# EAGLE design cheetah_driver_integrated_v2 (EAGLE 6.5.0)
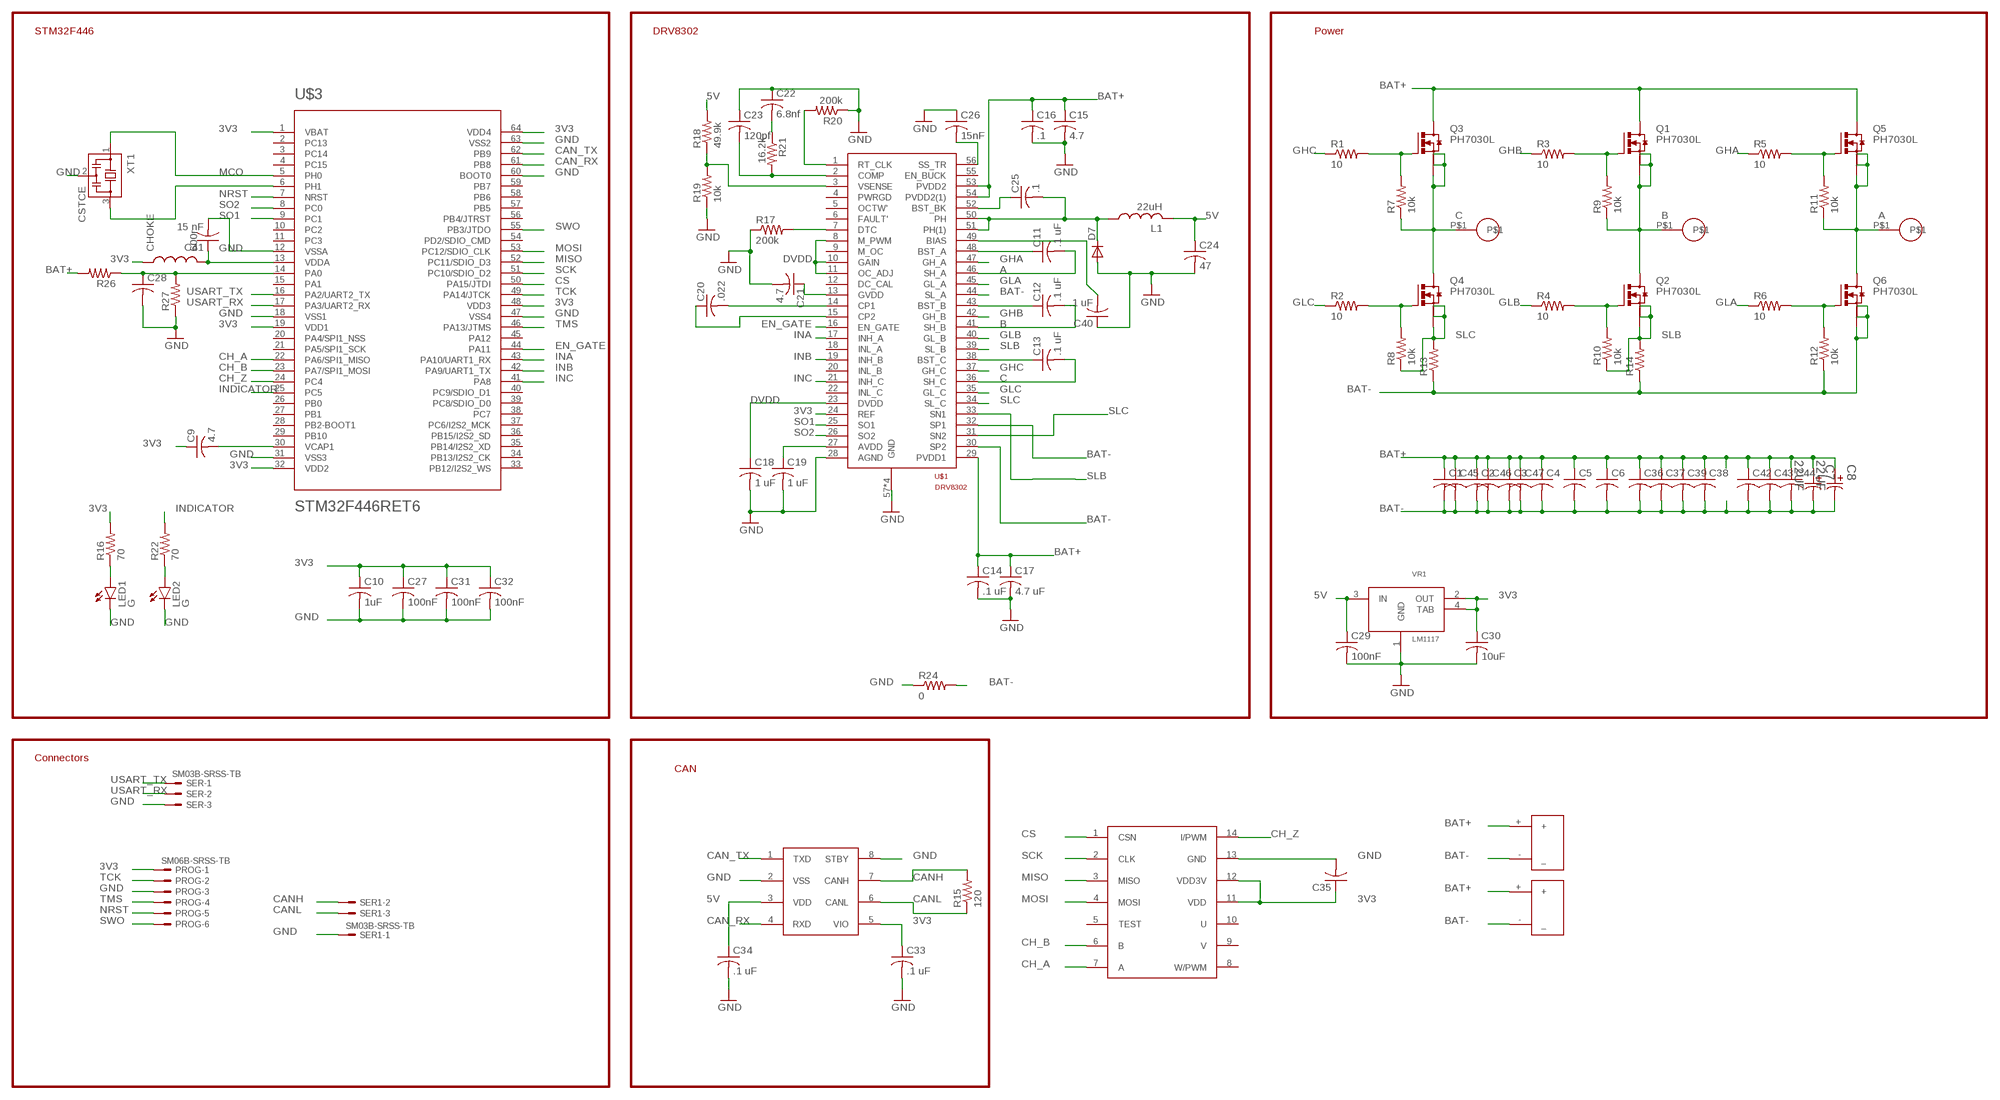
[diagram p0: schematic, sheet 1]

## Parts
C1  C-USC1206  [C1206]
C2  C-USC1206  [C1206]
C3  C-USC1206  [C1206]
C4  C-USC1206  [C1206]
C5  C-USC1206  [C1206]
C6  C-USC1206  [C1206]
C7  22UF  EEE-HD1V220AP-CASE-D  [CAPAE660X610N]
C8  22UF  EEE-HD1V220AP-CASE-D  [CAPAE660X610N]
C9  4.7  C-USC0603  [C0603]
C10  1uF  C-USC0603  [C0603]
C11  .1 uF  C-USC0603  [C0603]
C12  .1 uF  C-USC0603  [C0603]
C13  .1 uF  C-USC0603  [C0603]
C14  .1 uF  C-USC0603  [C0603]
C15  4.7  C-USC0805  [C0805]
C16  .1  C-USC0603  [C0603]
C17  4.7 uF  C-USC0805  [C0805]
C18  1 uF  C-USC0603  [C0603]
C19  1 uF  C-USC0603  [C0603]
C20  .022  C-USC0603  [C0603]
C21  4.7  C-USC0805  [C0805]
C22  6.8nf  C-USC0603  [C0603]
C23  120pf  C-USC0603  [C0603]
C24  47  C-USC1210  [C1210]
C25  .1  C-USC0603  [C0603]
C26  15nF  C-USC0603  [C0603]
C27  100nF  C-USC0603  [C0603]
C28  C-USC0603  [C0603]
C29  100nF  C-USC0603  [C0603]
C30  10uF  C-USC0805K  [C0805K]
C31  100nF  C-USC0603  [C0603]
C32  100nF  C-USC0603  [C0603]
C33  .1 uF  C-USC0603K  [C0603K]
C34  .1 uF  C-USC0603K  [C0603K]
C35  C-USC0603  [C0603]
C36  C-USC1206  [C1206]
C37  C-USC1206  [C1206]
C38  C-USC1206  [C1206]
C39  C-USC1206  [C1206]
C40  .1 uF  C-USC0603  [C0603]
C41  15 nF  C-USC0603  [C0603]
C42  C-USC1206  [C1206]
C43  C-USC1206  [C1206]
C44  C-USC1206  [C1206]
C45  C-USC1206  [C1206]
C46  C-USC1206  [C1206]
C47  C-USC1206  [C1206]
CHOKE  600r  INDUCTOR0603  [0603]
D7  DIODE-DO-214AC  [DO-214AC]
L1  22uH  L-USL4532P  [L4532P]
LED1  G  LED0603  [LED-0603]
LED2  G  LED0603  [LED-0603]
PROG  SM06B-SRSS-TB  [SM06B-SRSS-TB]
Q1  PH7030L  [SOT669]
Q2  PH7030L  [SOT669]
Q3  PH7030L  [SOT669]
Q4  PH7030L  [SOT669]
Q5  PH7030L  [SOT669]
Q6  PH7030L  [SOT669]
R1  10  R-US_R0603  [R0603]
R2  10  R-US_R0603  [R0603]
R3  10  R-US_R0603  [R0603]
R4  10  R-US_R0603  [R0603]
R5  10  R-US_R0603  [R0603]
R6  10  R-US_R0603  [R0603]
R7  10k  R-US_R0603  [R0603]
R8  10k  R-US_R0603  [R0603]
R9  10k  R-US_R0603  [R0603]
R10  10k  R-US_R0603  [R0603]
R11  10k  R-US_R0603  [R0603]
R12  10k  R-US_R0603  [R0603]
R13  R-US_R1210  [R1210]
R14  R-US_R1210  [R1210]
R15  120  R-US_R0603  [R0603]
R16  70  R-US_R0603  [R0603]
R17  200k  R-US_R0603  [R0603]
R18  49.9k  R-US_R0603  [R0603]
R19  10k  R-US_R0603  [R0603]
R20  200k  R-US_R0603  [R0603]
R21  16.2k  R-US_R0603  [R0603]
R22  70  R-US_R0603  [R0603]
R24  0  R-US_R0603  [R0603]
R26  R-US_R0603  [R0603]
R27  R-US_R0603  [R0603]
SER  SM03B-SRSS-TB  [SM03B-SRSS-TB]
SER1  SM03B-SRSS-TB  [SM03B-SRSS-TB]
U$1  DRV8302  [HTSSOP56]
U$2  18_AWG_PAD  [18_AWG_PAD]
U$3  STM32F446RET6  [TQFP64]
U$4  18_AWG_PAD  [18_AWG_PAD]
U$5  18_AWG_PAD  [18_AWG_PAD]
U$6  MCP2561  [SO08]
U$7  AS5147P  [TSSOP14]
U$8  DC_CONNECTOR  [XT30_HORIZONTAL]
U$9  DC_CONNECTOR  [XT30_HORIZONTAL]
VR1  LM1117  [SOT-223]
XT1  CSTCE  [CSTCE]

## Nets
3V3: C9.1 C10.1 C27.1 C30.1 C31.1 C32.1 C33.1 C35.1 CHOKE.1 PROG.1 R16.2 U$1.24(REF) U$3.1(VBAT) U$3.19(VDD1) U$3.32(VDD2) U$3.48(VDD3) U$3.64(VDD4) U$6.5(VIO) U$7.11(VDD) U$7.12(VDD3V) VR1.2(OUT) VR1.4(TAB)
5V: C24.1 C29.1 C34.1 L1.2 R18.2 U$6.3(VDD) VR1.3(IN)
A: C11.2 Q5.1(S) Q5.2(S) Q5.3(S) Q6.MB(D) R11.1 U$1.46(SH_A) U$5.P$1
B: C12.2 Q1.1(S) Q1.2(S) Q1.3(S) Q2.MB(D) R9.1 U$1.41(SH_B) U$4.P$1
BAT+: C1.1 C2.1 C3.1 C4.1 C5.1 C6.1 C7.1 C8.1 C14.1 C15.1 C16.1 C17.1 C36.1 C37.1 C38.1 C39.1 C42.1 C43.1 C44.1 C45.1 C46.1 C47.1 Q1.MB(D) Q3.MB(D) Q5.MB(D) R26.2 U$1.29(PVDD1) U$1.53(PVDD2) U$1.54(PVDD2(1)) U$8.+ U$9.+
BAT-: C1.2 C2.2 C3.2 C4.2 C5.2 C6.2 C7.2 C8.2 C36.2 C37.2 C38.2 C39.2 C42.2 C43.2 C44.2 C45.2 C46.2 C47.2 Q6.1(S) Q6.2(S) Q6.3(S) R12.1 R13.1 R14.1 R24.2 U$1.30(SP2) U$1.32(SP1) U$1.44(SL_A) U$8.-(_) U$9.-(_)
C: C13.2 Q3.1(S) Q3.2(S) Q3.3(S) Q4.MB(D) R7.1 U$1.36(SH_C) U$2.P$1
CAN_RX: U$3.61(PB8) U$6.4(RXD)
CAN_TX: U$3.62(PB9) U$6.1(TXD)
CANH: R15.2 SER1.2 U$6.7(CANH)
CANL: R15.1 SER1.3 U$6.6(CANL)
CH_A: U$3.22(PA6/SPI1_MISO) U$7.7(A)
CH_B: U$3.23(PA7/SPI1_MOSI) U$7.6(B)
CH_Z: U$3.24(PC4) U$7.14(I/PWM)
CS: U$3.50(PA15/JTDI) U$7.1(CSN)
DVDD: C18.1 U$1.8(M_PWM) U$1.10(GAIN) U$1.11(OC_ADJ) U$1.23(DVDD)
EN_GATE: U$1.16(EN_GATE) U$3.44(PA11)
GHA: R5.1 U$1.47(GH_A)
GHB: R3.1 U$1.42(GH_B)
GHC: R1.1 U$1.37(GH_C)
GLA: R6.1 U$1.45(GL_A)
GLB: R4.1 U$1.40(GL_B)
GLC: R2.1 U$1.35(GL_C)
GND: C10.2 C14.2 C15.2 C16.2 C17.2 C18.2 C19.2 C21.2 C22.1 C23.1 C24.2 C26.1 C27.2 C28.2 C29.2 C30.2 C31.2 C32.2 C33.2 C34.2 C35.2 C40.1 C41.2 D7.A LED1.C LED2.C PROG.3 R17.1 R19.1 R20.1 R24.1 R27.1 SER1.1 SER.3 U$1.28(AGND) U$1.57(GND) U$1.P$1(GND) U$1.P$2(GND) U$1.P$3(GND) U$3.12(VSSA) U$3.18(VSS1) U$3.31(VSS3) U$3.47(VSS4) U$3.60(BOOT0) U$3.63(VSS2) U$6.2(VSS) U$6.8(STBY) U$7.13(GND) VR1.1(GND) XT1.2
INA: U$1.17(INH_A) U$3.43(PA10/UART1_RX)
INB: U$1.19(INH_B) U$3.42(PA9/UART1_TX)
INC: U$1.21(INH_C) U$3.41(PA8)
INDICATOR: R22.2 U$3.25(PC5)
MCO: U$3.5(PH0) XT1.1
MISO: U$3.52(PC11/SDIO_D3) U$7.3(MISO)
MOSI: U$3.53(PC12/SDIO_CLK) U$7.4(MOSI)
N$1: Q3.4(G) R1.2 R7.2
N$2: C41.1 CHOKE.2 U$3.13(VDDA)
N$3: C9.2 U$3.30(VCAP1)
N$4: C11.1 U$1.48(BST_A)
N$5: C40.2 U$1.49(BIAS)
N$6: C13.1 U$1.38(BST_C)
N$7: Q4.4(G) R2.2 R8.2
N$8: Q1.4(G) R3.2 R9.2
N$9: C12.1 U$1.43(BST_B)
N$10: Q5.4(G) R5.2 R11.2
N$11: Q6.4(G) R6.2 R12.2
N$12: R18.1 R19.2 U$1.3(VSENSE)
N$13: R17.2 U$1.7(DTC)
N$14: C19.1 U$1.27(AVDD)
N$15: C20.2 U$1.14(CP1)
N$16: C20.1 U$1.15(CP2)
N$17: C21.1 U$1.13(GVDD)
N$18: C23.2 R21.2 U$1.2(COMP)
N$19: R20.2 U$1.1(RT_CLK)
N$20: C22.2 R21.1
N$21: C25.2 D7.C L1.1 U$1.50(PH) U$1.51(PH(1))
N$22: C25.1 U$1.52(BST_BK)
N$23: C26.2 U$1.56(SS_TR)
N$24: C28.1 R26.1 R27.2 U$3.14(PA0)
N$26: LED1.A R16.1
N$27: Q2.4(G) R4.2 R10.2
N$28: LED2.A R22.1
N$30: U$3.6(PH1) XT1.3
NRST: PROG.5 U$3.7(NRST)
SCK: U$3.51(PC10/SDIO_D2) U$7.2(CLK)
SLB: Q2.1(S) Q2.2(S) Q2.3(S) R10.1 R14.2 U$1.33(SN1) U$1.39(SL_B)
SLC: Q4.1(S) Q4.2(S) Q4.3(S) R8.1 R13.2 U$1.31(SN2) U$1.34(SL_C)
SO1: U$1.25(SO1) U$3.9(PC1)
SO2: U$1.26(SO2) U$3.8(PC0)
SWO: PROG.6 U$3.55(PB3/JTDO)
TCK: PROG.2 U$3.49(PA14/JTCK)
TMS: PROG.4 U$3.46(PA13/JTMS)
USART_RX: SER.2 U$3.17(PA3/UART2_RX)
USART_TX: SER.1 U$3.16(PA2/UART2_TX)
Unconnected: U$1.4(PWRGD) U$1.5(OCTW') U$1.6(FAULT') U$1.9(M_OC) U$1.12(DC_CAL) U$1.18(INL_A) U$1.20(INL_B) U$1.22(INL_C) U$1.55(EN_BUCK) U$3.2(PC13) U$3.3(PC14) U$3.4(PC15) U$3.10(PC2) U$3.11(PC3) U$3.15(PA1) U$3.20(PA4/SPI1_NSS) U$3.21(PA5/SPI1_SCK) U$3.26(PB0) U$3.27(PB1) U$3.28(PB2-BOOT1) U$3.29(PB10) U$3.33(PB12/I2S2_WS) U$3.34(PB13/I2S2_CK) U$3.35(PB14/I2S2_XD) U$3.36(PB15/I2S2_SD) U$3.37(PC6/I2S2_MCK) U$3.38(PC7) U$3.39(PC8/SDIO_D0) U$3.40(PC9/SDIO_D1) U$3.45(PA12) U$3.54(PD2/SDIO_CMD) U$3.56(PB4/JTRST) U$3.57(PB5) U$3.58(PB6) U$3.59(PB7) U$7.5(TEST) U$7.8(W/PWM) U$7.9(V) U$7.10(U)

## Notes on the sheet
- STM32F446 | DRV8302 | Power
- Connectors
- CAN

## Library data of the parts
C1-C6 C9-C47 = rcl:C-US: CAPACITOR, American symbol
C7 C8 = Panasonic-EEEH_EEET_EEHZ_EEV:EEE-: Aluminum Electrolytic Capacitors,Surface Mount Type; MPN: EEE-HD1V220AP; OC_FARNELL: 1714745; OC_NEWARK: 15R0968; PACKAGE: CASE-D; SUPPLIER: PANASONIC; TOLERANCE: ±20 %; VOLTAGERATING: 35V
CHOKE = SparkFun-Passives:INDUCTOR: Inductors Basic Inductor/Choke - 0603 and 1206. Footprints are not proven and vary greatly between part numbers. INDUCTOR POWER 3.3UH 4.0A SMD 0.197" L x 0.197" W x 0.177" H (5.00mm x 5.00mm x 4.50mm)
D7 = diode:DIODE-: DIODE
L1 = rcl:L-US: INDUCTOR, American symbol
LED1 LED2 = SparkFun-LED:LED: LEDs Standard schematic elements and footprints for 5mm, 3mm, 1206, and 0603 sized LEDs. 5mm - Spark Fun Electronics SKU : COM-00529 (and others)
PROG = con-jst2:?M06B-SRSS-TB: Disconnectable Crimp style connector, 1.0mm pitch 6 contacts
Q1-Q6 = transistor-power:PH7030L: N-channel TrenchMOS (TM) logic level FET Source: http://www.nxp.com/acrobat_download/datasheets/PH7030L_4.pdf
R1-R22 R24 R26 R27 = rcl:R-US_: RESISTOR, American symbol
SER SER1 = con-jst2:?M03B-SRSS-TB: Disconnectable Crimp style connector, 1.0mm pitch 3 contacts
U$1 = ASL (1):DRV8302
U$2 U$4 U$5 = BenLibrary:18_AWG_PAD
U$3 = BenLibrary:STM32F446RET6: ARM DSP Chip used on the WAV Trigger board.
U$6 = BenLibrary:MCP2561
U$7 = BenLibrary:AS5147P
U$8 U$9 = BenLibrary:DC_CONNECTOR
VR1 = sc_usercreated:LM1117
XT1 = sc_usercreated:CSTCE

## Board
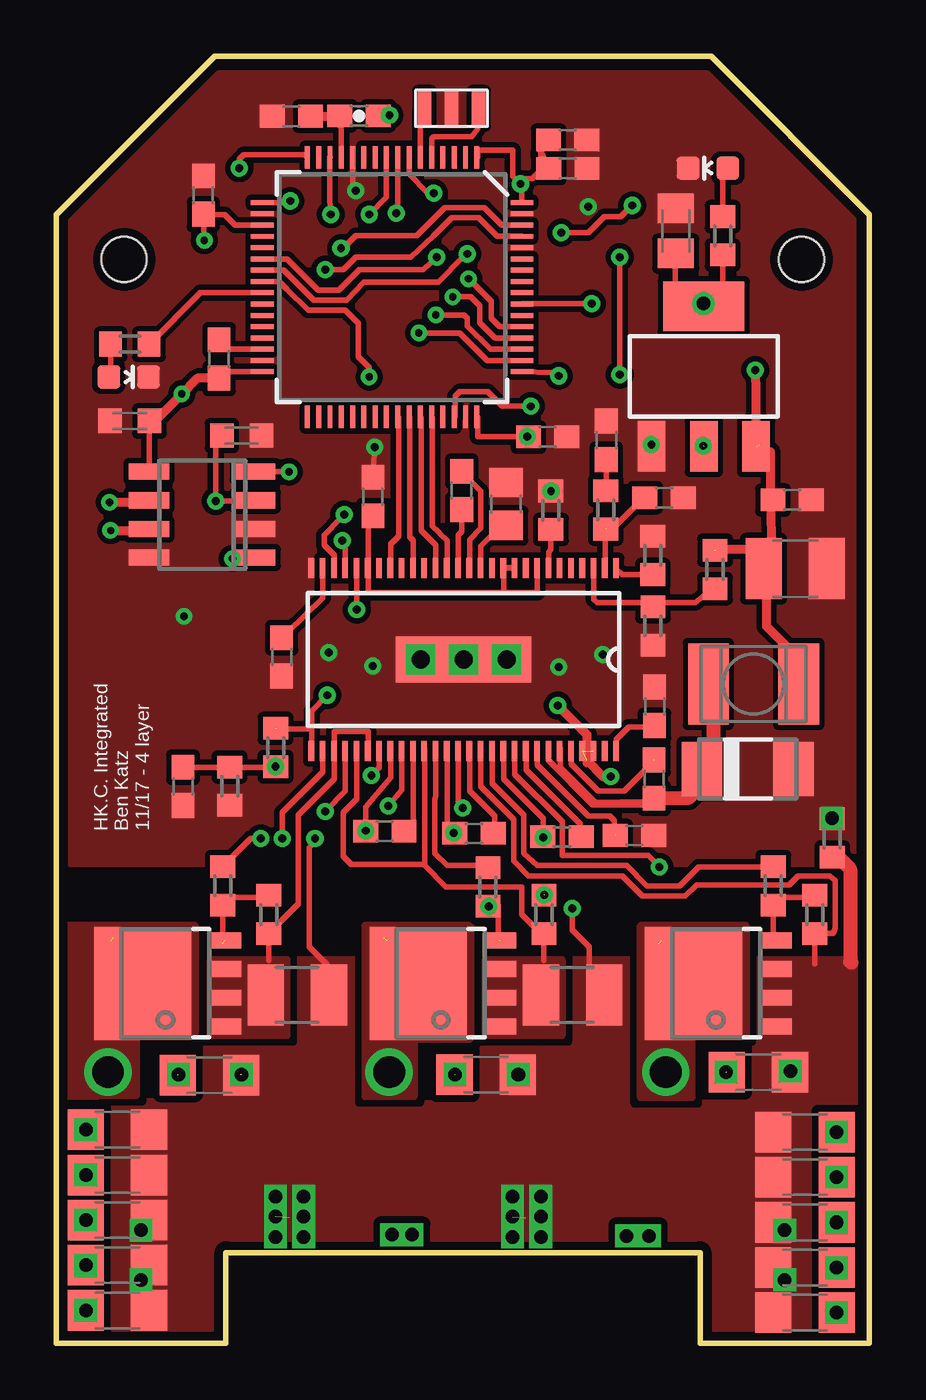
[diagram p1: board, top side]
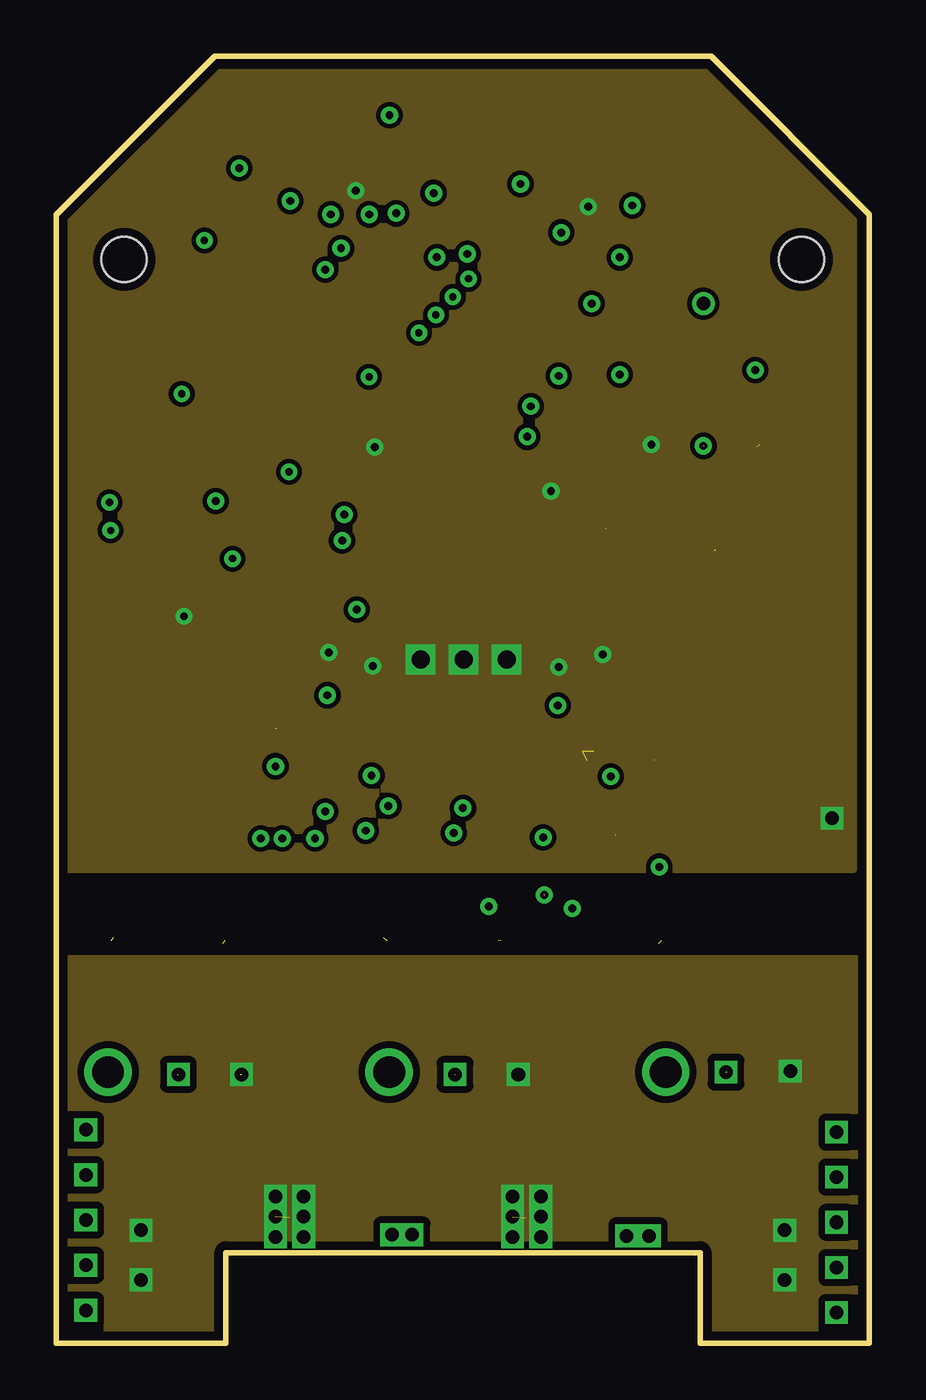
[diagram p2: board, inner layer Route2]
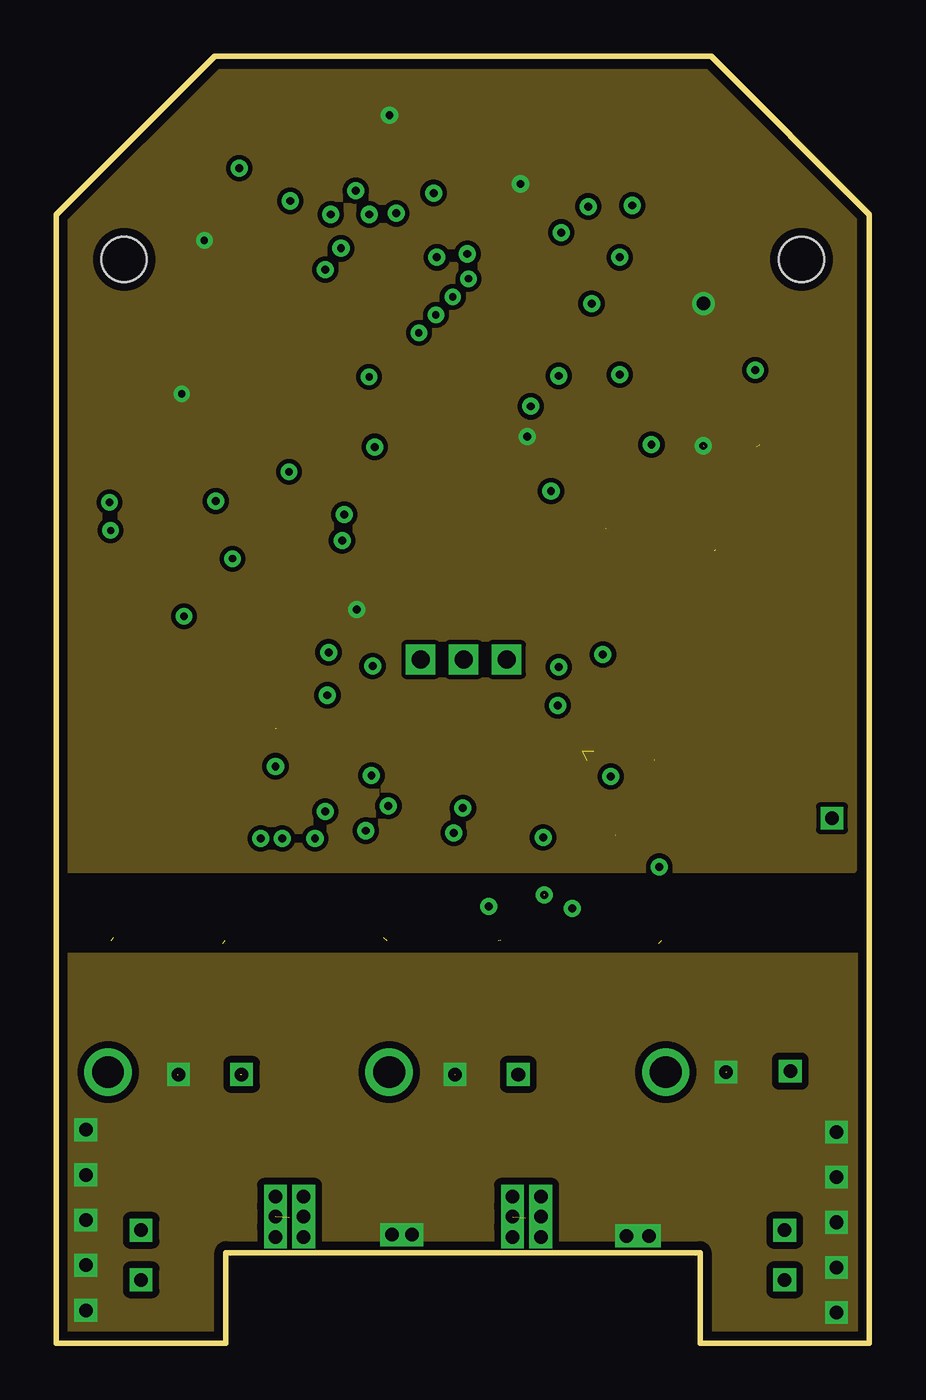
[diagram p3: board, inner layer Route3]
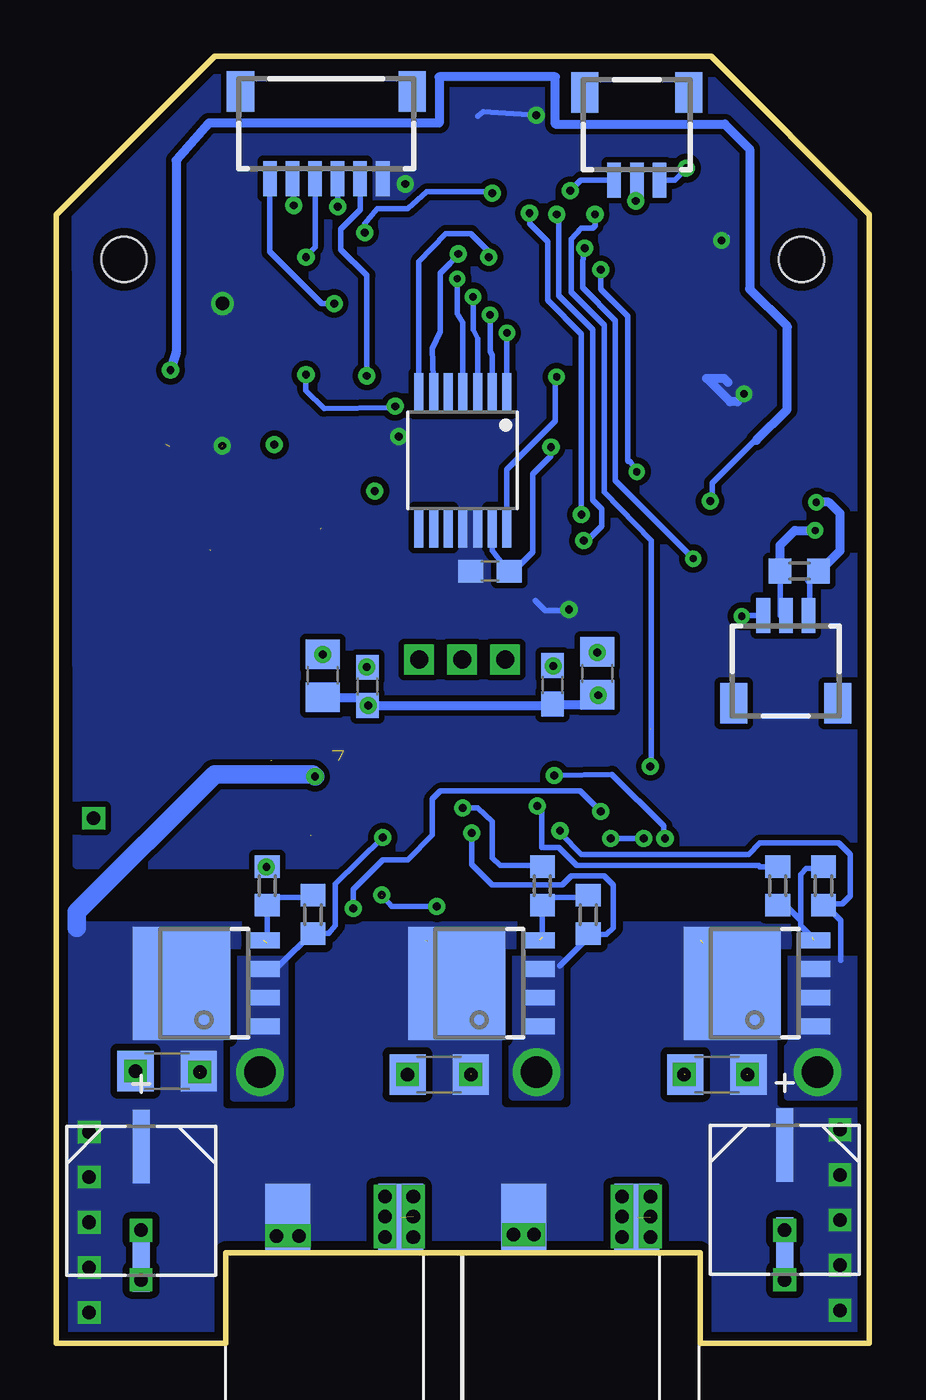
[diagram p4: board, bottom side, seen from below]

Size 36 x 57 mm. Coordinates in mm from the lower left corner, seen from the top.
Outline: 0,0 0,50 7,57 29,57 36,50 36,0 28.5,0 28.5,4 7.5,4 7.5,0 0,0
Copper layers (1*2+3*16): Top 0.035mm / dielectric 1.5mm / Route2 0.035mm / dielectric 0.15mm / Route3 0.035mm / dielectric 0.2mm / Bottom 0.035mm
Design rules "default *": minimum track width 6mil, minimum drill 24mil, track to track 8mil, track to pad 8mil, pad to pad 8mil, via to via 8mil, smd to smd 6mil, copper to edge 15mil, drill to drill 6mil, minimum pad ring 10mil, minimum via ring 8mil, stop-mask expansion 4mil, vias tented up to drill 0mil, thermal gap 10mil
Holes 2 mm at 3,48 33,48

### Footprints (pad centres in the part's own frame; a part is rotated, then mirrored left to right if it is on the bottom)
C1206 = smd 1.6 x 1.8: 1 -1.4,0; 2 1.4,0
CAPAE660X610N = smd 3.251 x 0.762: 1 -2.413,0; 2 2.413,0
C0603 = smd 1.1 x 1: 1 -0.85,0; 2 0.85,0
C0805 = smd 1.3 x 1.5: 1 -0.95,0; 2 0.95,0
C1210 = smd 1.6 x 2.7: 1 -1.4,0; 2 1.4,0
C0805K = smd 1.3 x 1.6: 1 -1,0; 2 1,0
C0603K = smd 1.05 x 1.08: 1 -0.875,0; 2 0.875,0
0603 = smd 1.1 x 1: 1 -0.85,0; 2 0.85,0
DO-214AC = smd 1.8 x 2.4: A 2.025,0; C -2.025,0
L4532P = smd 1.8 x 3.6: 1 -2,0; 2 2,0
LED-0603 = smd 1 x 1: A 0,-0.877; C 0,0.877
SM06B-SRSS-TB = smd 0.6 x 1.55: 1 -2.5,2.975; 2 -1.5,2.975; 3 -0.5,2.975; 4 0.5,2.975; 5 1.5,2.975; 6 2.5,2.975 | smd 1.2 x 1.8: FIT@1 -3.8,-0.9; FIT@2 3.8,-0.9
SOT669 = smd 0.7 x 1.4: 1 -1.905,-2.65; 2 -0.635,-2.65; 3 0.635,-2.65; 4 1.905,-2.65 | smd 5 x 4.3: MB 0,1
R0603 = smd 1 x 1.1: 1 -0.85,0; 2 0.85,0
R1210 = smd 1.6 x 2.7: 1 -1.4,0; 2 1.4,0
SM03B-SRSS-TB = smd 0.6 x 1.55: 1 -1,2.975; 2 0,2.975; 3 1,2.975 | smd 1.2 x 1.8: FIT@1 -2.3,-0.9; FIT@2 2.3,-0.9
HTSSOP56 = smd 0.9 x 0.25: 1 -4.05,6.75; 2 -4.05,6.25; 3 -4.05,5.75; 4 -4.05,5.25; 5 -4.05,4.75; 6 -4.05,4.25; 7 -4.05,3.75; 8 -4.05,3.25; 9 -4.05,2.75; 10 -4.05,2.25; 11 -4.05,1.75; 12 -4.05,1.25; 13 -4.05,0.75; 14 -4.05,0.25; 15 -4.05,-0.25; 16 -4.05,-0.75; 17 -4.05,-1.25; 18 -4.05,-1.75; 19 -4.05,-2.25; 20 -4.05,-2.75; 21 -4.05,-3.25; 22 -4.05,-3.75; 23 -4.05,-4.25; 24 -4.05,-4.75; 25 -4.05,-5.25; 26 -4.05,-5.75; 27 -4.05,-6.25; 28 -4.05,-6.75; 29 4.05,-6.75; 30 4.05,-6.25; 31 4.05,-5.75; 32 4.05,-5.25; 33 4.05,-4.75; 34 4.05,-4.25; 35 4.05,-3.75; 36 4.05,-3.25; 37 4.05,-2.75; 38 4.05,-2.25; 39 4.05,-1.75; 40 4.05,-1.25; 41 4.05,-0.75; 42 4.05,-0.25; 43 4.05,0.25; 44 4.05,0.75; 45 4.05,1.25; 46 4.05,1.75; 47 4.05,2.25; 48 4.05,2.75; 49 4.05,3.25; 50 4.05,3.75; 51 4.05,4.25; 52 4.05,4.75; 53 4.05,5.25; 54 4.05,5.75; 55 4.05,6.25; 56 4.05,6.75 | smd 2.032 x 6: 57 0,0 | drill 0.8 square: P$1 0,0; P$2 0,1.905; P$3 0,-1.905
18_AWG_PAD = drill 1.4: P$1 0,0
TQFP64 = smd 0.22 x 1: 1 -3.75,-5.75; 2 -3.25,-5.75; 3 -2.75,-5.75; 4 -2.25,-5.75; 5 -1.75,-5.75; 6 -1.25,-5.75; 7 -0.75,-5.75; 8 -0.25,-5.75; 9 0.25,-5.75; 10 0.75,-5.75; 11 1.25,-5.75; 12 1.75,-5.75; 13 2.25,-5.75; 14 2.75,-5.75; 15 3.25,-5.75; 16 3.75,-5.75; 33 3.75,5.75; 34 3.25,5.75; 35 2.75,5.75; 36 2.25,5.75; 37 1.75,5.75; 38 1.25,5.75; 39 0.75,5.75; 40 0.25,5.75; 41 -0.25,5.75; 42 -0.75,5.75; 43 -1.25,5.75; 44 -1.75,5.75; 45 -2.25,5.75; 46 -2.75,5.75; 47 -3.25,5.75; 48 -3.75,5.75 | smd 1 x 0.22: 17 5.75,-3.75; 18 5.75,-3.25; 19 5.75,-2.75; 20 5.75,-2.25; 21 5.75,-1.75; 22 5.75,-1.25; 23 5.75,-0.75; 24 5.75,-0.25; 25 5.75,0.25; 26 5.75,0.75; 27 5.75,1.25; 28 5.75,1.75; 29 5.75,2.25; 30 5.75,2.75; 31 5.75,3.25; 32 5.75,3.75; 49 -5.75,3.75; 50 -5.75,3.25; 51 -5.75,2.75; 52 -5.75,2.25; 53 -5.75,1.75; 54 -5.75,1.25; 55 -5.75,0.75; 56 -5.75,0.25; 57 -5.75,-0.25; 58 -5.75,-0.75; 59 -5.75,-1.25; 60 -5.75,-1.75; 61 -5.75,-2.25; 62 -5.75,-2.75; 63 -5.75,-3.25; 64 -5.75,-3.75
SO08 = smd 0.72 x 1.78: 1 -1.905,-2.35; 2 -0.635,-2.35; 3 0.635,-2.35; 4 1.905,-2.35; 5 1.905,2.35; 6 0.635,2.35; 7 -0.635,2.35; 8 -1.905,2.35
TSSOP14 = smd 0.4 x 1.78: 1 -1.95,-2.975; 2 -1.3,-2.975; 3 -0.65,-2.975; 4 0,-2.975; 5 0.65,-2.975; 6 1.3,-2.975; 7 1.95,-2.975; 8 1.95,2.975; 9 1.3,2.975; 10 0.65,2.975; 11 0,2.975; 12 -0.65,2.975; 13 -1.3,2.975; 14 -1.95,2.975
XT30_HORIZONTAL = smd 2 x 3: + -2.5,1.5; - 2.5,1.5
SOT-223 = smd 1.219 x 2.235: 1 -2.311,-3.099; 2 0,-3.099; 3 2.311,-3.099 | smd 3.6 x 2.2: 4 0,3.099
CSTCE = smd 0.6 x 1.6: 1 -1.2,0; 2 0,0; 3 1.2,0

### Placement (x,y rotation side)
C1  31.09,12 0 top
C2  2.7,7.45 0 top
C3  19.03,11.9 0 top
C4  6.78,11.88 0 top
C5  33.15,3.35 180 top
C6  2.7,1.45 0 top
C7  32.25,6.3 270 bottom
C8  3.75,6.35 270 bottom
C9  7.2,43.59 90 top
C10  22.65,52.04 0 top
C11  22.39,22.43 180 top
C12  18.49,22.58 180 top
C13  14.54,22.68 180 top
C14  14.03,29.16 90 bottom
C15  24.21,29.57 90 bottom
C16  22.22,29.09 90 bottom
C17  12.05,29.67 90 bottom
C18  14.01,37.5 90 top
C19  9.97,30.4 270 top
C20  17.95,37.77 90 top
C21  19.91,37.17 90 top
C22  24.35,40 270 top
C23  26.91,37.45 180 top
C24  32.72,34.3 0 top
C25  26.47,24.99 270 top
C26  26.49,28.21 270 top
C27  6.51,50.86 90 top
C28  5.61,24.66 270 top
C29  32.58,37.35 0 top
C30  27.43,49.27 90 top
C31  22.64,53.3 0 top
C32  21.75,40.14 0 top
C33  3.25,40.85 180 top
C34  8.2,40.2 0 top
C35  16.8,34.2 0 bottom
C36  2.7,3.45 0 top
C37  33.15,1.35 180 top
C38  31.1,12.05 180 bottom
C39  6.75,11.9 180 bottom
C40  25.6,22.49 180 top
C41  10.4,54.35 180 top
C42  33.15,5.35 180 top
C43  19.05,11.9 180 bottom
C44  33.15,7.35 180 top
C45  2.7,5.45 0 top
C46  2.7,9.45 0 top
C47  33.15,9.35 180 top
CHOKE  13.4,54.37 180 top
D7  30.62,25.43 0 top
L1  30.87,29.19 0 top
LED1  28.85,52.05 90 top
LED2  3.2,42.8 270 top
PROG  24.05,54.55 180 bottom
Q1  17.27,15.94 90 bottom
Q2  17.02,15.94 90 top
Q3  5.08,15.94 90 bottom
Q4  4.83,15.94 90 top
Q5  29.46,15.94 90 bottom
Q6  29.21,15.94 90 top
R1  4.06,20.26 270 bottom
R2  7.37,20.26 270 top
R3  14.48,20.26 270 bottom
R4  19.11,20.21 270 top
R5  26.67,20.26 270 bottom
R6  31.75,20.26 270 top
R7  2.03,20.26 90 bottom
R8  9.4,18.99 90 top
R9  12.45,18.99 90 bottom
R10  21.59,18.99 90 top
R11  24.64,18.99 90 bottom
R12  33.58,18.99 90 top
R13  10.67,15.43 180 top
R14  22.86,15.43 180 top
R15  3.1,34.2 180 bottom
R16  29.5,49.05 270 top
R17  21.9,36.89 270 top
R18  29.16,34.27 90 top
R19  26.42,31.77 90 top
R20  26.41,34.9 270 top
R21  24.33,36.91 270 top
R22  3.25,44.25 0 top
R24  34.36,22.38 270 top
R26  9.71,26.38 90 top
R27  7.67,24.67 90 top
SER  10.3,54.5 180 bottom
SER1  3.7,29.25 0 bottom
U$1  18.03,30.28 270 top
U$2  2.29,12 0 top
U$3  14.86,46.78 180 top
U$4  14.74,12 0 top
U$5  26.98,12 0 top
U$6  6.45,36.7 90 top
U$7  18,39.1 180 bottom
U$8  23.25,4.05 0 bottom
U$9  12.8,4.05 0 bottom
VR1  28.67,42.82 0 top
XT1  17.5,54.7 180 top

### Tracks (layer width: path | path; a pad name or v marks a point on that pad's centre or on a via)
3V3  (via drill 0.32, 0.35, 0.6)  (1 unrouted)
  Top 0.25: U$3.1 18.65,52.53 18.65,52.55 | U$1.24 13.3,34.33 13.3,34.3 | 18.65,41 18.65,41.03 U$3.48 | VR1.2 28.9,39.83 28.65,39.8 | 20.2,52.85 20.2,51.7 v20.55,51.35
  Top 0.254: 18.65,41 18.65,40.15 v20.85,40.15 | 13.3,34.3 v13.3,32.5 | 20.2,52.85 18.65,52.85 18.65,52.55 | CHOKE.1 14.82,54.37 v14.75,54.4 | U$6.5 4.1,39.92 C33.1 | C31.1 21.37,52.84 C10.1 21.45,52.81 21.45,51.95 21.07,51.58 20.77,51.58 v20.55,51.35 20.61,51.29 U$3.64 | C30.1 27.98,48.13 27.4,48.05 27.4,46.85 v28.65,46.05 28.82,45.97 VR1.4 29.5,47 R16.2 | U$3.32 7.49,43.03 C9.1 | U$3.19 7.92,49.53 7.45,50 C27.1 | C27.1 | C27.1 6.52,49.27 v6.55,48.85
  Top 0.406: v20.85,40.15 21.04,40.15 C32.1 | C33.1 4.35,40.85 v5.55,42.05 6.24,42.74 C9.1
  Bottom 0.254: 13.3,32.45 14.35,32.45 14.8,32.9 | v14.75,54.4 17.1,54.55 17.35,54.35 | v20.55,51.35 20.55,51.45 20.5,51.5 | v6.55,48.85 6.4,48.75 6.3,49 | v5.55,42.05 5.4,42.05 5.85,41.7
  Bottom 0.406: 5.85,41.7 6.16,41.7 C9.1 6.44,42.74 6.25,42.55
  other vias: 28.65,39.75
  pour Bottom (isolate 0.254, no thermals): 0.65,56.25 35.15,56.25 35.1,21.2 0.6,21.2
  pour Route3: 0.5,56.25 35.25,56.25 35.25,21 0.5,21
5V  (via drill 0.35)  (2 unrouted)
  Top 0.25: 32.85,29.75 32.87,29.75 L1.2 | 31.45,33.6 31.32,33.6 C24.1 | 29.31,35.05 R18.2 | 31.15,39.8 31.13,39.95 | C29.1 31.63,37.35 31.63,37.4
  Top 0.254: U$6.3 8.77,37.3 v7.05,37.3 7.05,39.8 C34.1
  Top 0.406: 32.75,29.85 32.75,30.45 31.45,31.75 31.45,33.6 30.8,35.15 | 30.8,35.15 29.2,35.15 | 30.8,35.15 31.65,35 31.63,37.4 31.63,39.48 VR1.3 30.98,42.38 v30.95,43.1
  Top 0.61: 32.75,29.85 32.85,29.75
  Bottom 0.254: 5,40 5.05,40 6.95,38.1 6.95,37.4 v7.05,37.3
  Bottom 0.406: 5,40 3.64,41.36 3.64,44.95 3.64,45.04 5.3,46.7 5.3,52.9 6.4,54 13.9,54 13.9,56.1 19.05,56.1 19.05,54.05 29.25,54.05 30.7,52.4 30.7,43.9 v30.95,43.1
A  (via drill 0.35)
  Top 0.25: 19.8,26.4 19.78,26.4 U$1.46 | C11.2 v21.55,22.4
  Top 0.254: 19.8,26.4 19.8,25 21.55,23.25 v21.55,22.4
  Bottom 0.25: 24.64,18.22 R11.1
  Bottom 0.254: 24.64,18.22 26.16,16.7 | v21.55,22.4 23.65,20.35 23.65,18.5 23.95,18.15 R11.1
  pour Top (isolate 0.305, rank 2, no thermals): 30.5,18.48 30.5,13.65 28.1,13.6 28.1,10.9 25.91,10.9 25.91,18.48
  pour Bottom (isolate 0.305, no thermals): 25.91,16.95 28.13,16.95 28.13,10.9 25.91,10.9
B  (via drill 0.35)
  Top 0.25: U$1.41 17.3,26.23 17.3,26.2 | 17.6,22.55 v17.6,22.6 17.64,22.6 C12.2
  Top 0.254: 17.3,26.35 17.3,26.2 17.3,22.85 17.6,22.55
  Bottom 0.25: R9.1
  Bottom 0.254: 12.45,18.22 R9.1 12.45,17.97 13.72,16.7 | v17.6,22.6 17.6,21.2 16.7,20.3 13.6,20.3 13.2,20.7 11.75,20.7 11.35,20.3 11.35,18.4 11.65,18.1 12.4,18.1 R9.1
  pour Top (isolate 0.305, rank 2, no thermals): 18.3,18.48 18.3,13.5 15.8,13.5 15.8,10.95 13.72,10.95 13.72,18.48
  pour Bottom (isolate 0.305, no thermals): 13.72,16.95 15.79,16.95 15.79,10.95 13.72,10.95
BAT+  (via drill 0.35, 0.6)  (6 unrouted)
  Top 0.25: U$1.29 11.3,26.23 11.3,26.3
  Top 0.254: v12,28.7 11.3,28 11.3,27.2 | 11.3,27.2 11.3,26.3 11.3,26.2 | 9.7,27.2 11.3,27.2
  Top 0.406: 23.5,25.8 23.5,26.95 v22.2,28.25 | 23.5,25.8 23.5,25.7 | 23.5,25.8 24.2,25.1 v24.55,25.1
  Bottom 0.25: v12,28.7 12.05,28.7 C17.1 12.05,28.7 | 14,28.25 14.03,28.25 C14.1 | v22.2,28.25 C16.1 | 24.2,28.6 24.21,28.6 C15.1
  Bottom 0.406: 24.2,28.6 22.55,28.6 v22.2,28.25 14,28.25 13.95,28.3 12.45,28.3 12.05,28.7
  Bottom 0.813: 35.1,18.4 35.1,19.1 29,25.2 24.65,25.2 v24.55,25.1
  other vias: 1.3,5.45 34.55,1.35 1.3,3.45 1.3,7.45 1.3,9.45 1.3,1.45 34.55,3.35 34.55,5.35 34.55,7.35 34.55,9.35 29.65,12 17.65,11.9 5.4,11.9 14.85,4.8 15.75,4.8 25.25,4.75 26.25,4.75
  pour Bottom (isolate 0.305, rank 2, no thermals): 0.25,18.48 35.36,18.48 35.36,0 0.25,0
  pour Route3 (isolate 0.305): 0.05,17.1 36.05,17.1 36.05,0.05 0.05,0.05 0.05,17.05
BAT-  (via drill 0.35, 0.6)  (3 unrouted)
  Top 0.25: 11.8,26.3 11.78,26.3 U$1.30 | 12.8,26.35 12.78,26.35 U$1.32 | U$1.44 18.8,26.23 18.8,26.3 | R12.1 33.78,18.15 | 34.3,21.65 34.31,21.65 R24.2
  Top 0.254: 33.78,18.22 33.78,18.15 | 33.78,18.15 R12.1 33.58,16.8 | 18.8,26.35 18.8,26.3 18.8,24.65 20.25,23.2 20.25,21.35 20.9,20.7 25.05,20.7 25.95,19.8 27.85,19.8 28.35,20.3 32.45,20.3 32.85,20.7 34.25,20.7 34.5,20.5 34.5,18.4 34.4,18.15 33.78,18.15 | 33.78,18.15 33.75,18.15 | v22.85,19.25 22.85,18.3 23.6,17.55 23.6,16.75 | 12.8,26.35 12.8,24.45 v11.9,23.55 | 11.8,26.3 11.8,25.3 10,23.5 v10,22.35 | v11.45,22.35 11.45,22.2 11.2,21.95 11.2,17.55 12,16.75 | 34.3,21.65 34.6,21.65
  Top 0.61: 34.47,21.53 34.62,21.53 35.15,21 35.15,16.9 35.2,16.85
  Top 0.813: R24.2 34.47,21.53
  Bottom 0.254: v22.85,19.25 22.85,20.05 22.85,20.1 21.55,21.4 20.45,21.4 19.35,22.5 19.35,24.1 19,24.45 12.8,24.45 v11.9,23.55 | v10,22.35 v11.45,22.35
  Bottom 0.406: C8.2 v3.75,2.8 | C7.2 v32.25,2.8
  other vias: 9.7,6.5 10.95,6.5 10.95,5.6 9.7,5.6 20.2,6.5 21.45,6.5 21.45,4.7 20.2,4.7 20.2,5.6 9.7,4.7 21.45,5.6 10.95,4.7 8.2,11.9 20.45,11.9 32.5,12.05 3.75,5 32.25,5
  pour Top (isolate 0.305, rank 3, no thermals): 0.25,16.95 35.36,16.95 35.36,0 0.25,0
  pour Route2 (isolate 0.305): 0.4,17 35.9,17 35.95,0.1 0.45,0.1
C  (via drill 0.35)
  Top 0.25: 14.8,26.35 14.78,26.35 U$1.36 | v13.7,22.7 v13.69,22.7 C13.2
  Top 0.254: 14.8,26.35 14.8,25.05 13.7,23.75 v13.7,22.7
  Bottom 0.25: R7.1 2.05,19.41 2.05,19.45 2.03,19.45 2.03,19.49
  Bottom 0.254: 2.03,19.49 1.27,18.73 1.27,16.95 | v13.7,22.7 13.65,22.55 12.75,21.65 5.35,21.65 4.85,22.15 1.35,22.15 0.85,21.65 0.85,19.8 1.2,19.45 2.05,19.45
  pour Top (isolate 0.305, rank 2, no thermals): 6.1,18.48 6.1,13.75 4,13.75 3.5,13.7 3.5,11 0.25,10.95 0.25,18.48
  pour Bottom (isolate 0.305, no thermals): 3.6,16.95 3.6,10.95 0.25,10.95 0.25,16.95
CAN_RX  (via drill 0.32, 0.35)
  Top 0.254: v10.3,38.6 U$6.4 | v11.9,47.55 12.7,47.55 13.25,48.1 15.7,48.1 16.68,49.03 17.5,49.85 18.7,49.85 19.52,49.03 U$3.61
  Bottom 0.254: v10.3,38.6 10.6,39.05 10.65,39.05 10.7,39.1 10.7,45.5 11.9,46.7 v11.9,47.55
CAN_TX  (via drill 0.32, 0.35)
  Top 0.254: v7.8,34.75 8.76,34.75 U$6.1 | U$3.62 19.72,49.53 18.95,50.3 17.2,50.3 16.43,49.53 15.95,49.05 13.25,49.05 12.7,48.5 v12.6,48.5
  Bottom 0.254: v7.8,34.75 10.9,37.85 11.25,38.2 11.25,45.3 12.7,46.75 12.7,47.9 v12.6,48.5
CANH  (via drill 0.32)
  Top 0.406: v2.4,36 4.04,36 U$6.7
  Bottom 0.254: SER1.2 3.95,32.23 R15.2
  Bottom 0.406: 3.65,33.9 R15.2 3.95,35.35 3.3,36 v2.4,36
CANL  (via drill 0.32)
  Top 0.406: v2.35,37.25 4.01,37.25 U$6.6
  Bottom 0.254: SER1.3 2.65,32.23 2.65,33.8
  Bottom 0.406: 2.65,33.8 R15.1 2.2,34.2 1.3,35.1 1.3,36.75 1.8,37.25 v2.35,37.25
CH_A  (via drill 0.35)
  Top 0.254: U$3.22 10.22,48.03 11.6,46.65 12.35,46.65 12.5,46.65 13.4,47.55 16.25,47.55 v16.85,48.1
  Bottom 0.254: v16.85,48.1 16.85,48.35 17.65,49.15 18.75,49.15 19.95,47.9 U$7.7
CH_B  (via drill 0.35)
  Top 0.254: U$3.23 10.07,47.53 11.4,46.2 12.85,46.2 13.6,47 16.9,47 18,48.1 v18.2,48.25
  Bottom 0.254: v18.2,48.25 18.55,47.85 19,47.4 19,44.8 19.35,44.05 U$7.6
CH_Z  (via drill 0.32)
  Top 0.254: U$3.24 9.87,47.03 10.2,46.7 11.15,45.75 12.8,45.75 12.97,45.58 | 12.97,45.58 13.15,45.4 | v13.85,42.8 13.85,43.23 13.37,43.7 13.37,45.18 12.97,45.58
  Bottom 0.254: U$7.14 16.05,38.7 13.9,40.85 13.9,42.75 v13.85,42.8
CS  (via drill 0.32)
  Top 0.254: U$3.50 19.07,43.53 17.85,44.75 v16.05,44.75
  Bottom 0.254: v16.05,44.75 U$7.1
DVDD
  Top 0.25: 13.8,34.35 13.78,34.35 U$1.23 | C18.1 13.8,36.65 13.8,36.6 | U$1.10 U$1.11 19.8,34.33 19.8,34.3 | U$1.8 21.3,34.33 21.3,34.3
  Top 0.254: 13.8,34.35 13.8,34.3 | 13.8,34.3 13.8,33.25 19.8,33.25 | 19.8,33.25 19.8,34.3 19.8,34.35 20.3,34.35 | 19.8,33.25 21.3,33.25 21.3,34.3 21.3,34.35 | 13.8,36.6 13.8,34.35 | 13.8,34.35 13.8,34.3
EN_GATE
  Top 0.25: 16.65,41 16.61,41 U$3.44 | U$1.16 17.3,34.33 17.3,34.3
  Top 0.254: 16.65,41 16.65,36.2 16.95,35.9 17,35.85 17.3,35.55 17.3,34.3
GHA  (via drill 0.35)
  Top 0.25: 20.3,26.3 20.28,26.3 U$1.47
  Top 0.254: 20.3,26.3 20.3,25.2 22.4,23.1 22.4,21.6 22.8,21.6 26.2,21.6 v26.7,21.1
  Bottom 0.25: v26.7,21.1 R5.1
GHB  (via drill 0.35)
  Top 0.25: U$1.42 17.8,26.23 17.8,26.25
  Top 0.254: 17.8,26.3 17.8,26.25 17.8,23.9 v18,23.7
  Bottom 0.25: R3.1 14.5,21.11 14.5,21.15
  Bottom 0.254: v18,23.7 17.35,23.7 16.7,23.1 16.7,21.5 16.35,21.15 14.5,21.15
GHC  (via drill 0.35)
  Top 0.25: 15.3,26.3 15.28,26.3 U$1.37
  Top 0.254: 15.3,26.3 15.3,24.5 v14.7,23.8
  Bottom 0.25: 4.1,21.1 R1.1
  Bottom 0.254: v14.7,23.8 14.5,23.55 14.5,21.95 14.15,21.95 13.75,21.95 12.95,21.15 4.9,21.15 4.85,21.1 4.1,21.1
GLA
  Top 0.25: U$1.45 19.3,26.23 19.3,26.3 | R6.1
  Top 0.254: 19.3,26.4 19.3,26.3 19.3,24.8 20.7,23.4 20.7,21.7 21.3,21.15 22.6,21.15 22.8,21.15 25.25,21.15 26.15,20.25 27.6,20.25 28.45,21.1 31.55,21.1 R6.1 31.8,21.1
GLB
  Top 0.25: U$1.40 16.8,26.23 16.8,26.25 | 19.55,21.15 19.11,21.15 R4.1
  Top 0.254: 16.8,26.35 16.8,26.25 16.8,24.25 16.75,24.05 16.75,21.7 17.3,21.15 19.55,21.15
GLC  (via drill 0.35)
  Top 0.25: 14.3,26.35 14.28,26.35 U$1.35 | 7.35,21.1 R2.1
  Top 0.254: 14.3,26.35 14.3,25.5 v13.95,25.15 | v9.05,22.35 8.6,22.35 7.35,21.1
  Bottom 0.254: v13.95,25.15 11.4,25.2 9.1,22.9 9.1,22.4 v9.05,22.35
GND  (via drill 0.32, 0.35, 0.6)
  Top 0.254: v13.25,51.05 13.11,51.19 U$3.12 | v23.55,50.35 23.55,50.2 | v14.1,39.7 14,38.36 C18.2 | v5.65,32.2 5.75,32.2 5.75,32.15
  Bottom 0.25: C17.2 v12.05,30.6 | C14.2 v14,30.01 v14,30 | v22.25,29.95 C16.2 | v24.2,30.5 24.21,30.5 C15.2
  Bottom 0.254: SER.3 12.78,51.52 v13.25,51.05 | PROG.3 v23.55,50.35 | U$7.13 16.7,35.1 16.2,34.45 C35.2 15.65,34.3 14.9,35.05 14.9,38.5 14.1,39.3 v14.1,39.7 | SER1.1 5.65,32.23 v5.65,32.2
  other vias: 34.35,23.25 21.9,37.75 26.35,39.8
  pour Top (isolate 0.24, no thermals): 0.6,56.25 0.6,21.2 35.3,21.2 35.3,56.25
  pour Route2: 0.5,56.25 35.25,56.25 35.25,21 0.5,21
INA
  Top 0.25: 16.15,41 16.11,41 U$3.43 | U$1.17 16.8,34.33 16.8,34.35
  Top 0.254: 16.15,41 16.15,36 16.5,35.65 16.8,35.35 16.8,34.35
INB
  Top 0.25: 15.65,41 15.61,41 U$3.42 | 15.8,34.3 15.78,34.3 U$1.19
  Top 0.254: 15.65,41 15.65,35.7 15.8,35.55 15.8,34.3
INC
  Top 0.25: 15.15,41 15.11,41 U$3.41 | U$1.21 14.8,34.33 14.8,34.35
  Top 0.254: 15.15,41 15.15,35.75 14.8,35.4 14.8,34.35
INDICATOR
  Top 0.254: U$3.25 6.38,46.53 R22.2
MCO
  Top 0.254: U$3.5 16.61,53.36 16.7,53.45 18.4,53.45 18.65,53.8 XT1.1
MISO  (via drill 0.32)
  Top 0.254: U$3.52 19.42,44.53 18.75,45.2 18.75,45.95 18.35,46.35 17.6,46.35 v17.55,46.35
  Bottom 0.254: v17.55,46.35 17.55,44.9 17.35,44.5 17.35,43.52 U$7.3
MOSI  (via drill 0.32)
  Top 0.254: U$3.53 19.62,45.03 19.25,45.4 19.25,46.15 v18.25,47.15
  Bottom 0.254: v18.25,47.15 18.25,45.6 18,45.2 U$7.4
N$1  (1 unrouted)
  Bottom 0.25: 2.03,21.02 R7.2 | 4.06,19.49 R1.2
  Bottom 0.254: 2.03,21.02 2.79,21.02 3.05,20.76 3.05,18.73 | 2.54,17.97 3.05,18.48 3.05,18.73 | 3.05,18.73 3.81,19.49 4.06,19.49
N$2
  Top 0.254: U$3.13 12.61,53.68 CHOKE.2
  Top 0.406: C41.1 12.55,54.35 CHOKE.2
N$3
  Top 0.254: U$3.30 7.62,44.03 C9.2
N$4
  Top 0.25: U$1.48 20.8,26.23 20.8,26.25 | C11.1 23.2,22.43 23.2,22.45
  Top 0.254: 20.8,26.35 20.8,26.25 20.8,25.4 23.2,23 23.2,22.45
N$5  (1 unrouted)
  Top 0.25: U$1.49 21.3,26.23 21.3,26.3
  Top 0.254: 21.3,26.35 21.3,26.3 21.3,25.6 23.55,23.35 24.5,23.35 24.7,23.15 24.7,22.55 C40.2
N$6
  Top 0.25: 15.8,26.35 15.78,26.35 U$1.38 | 15.35,22.65 15.39,22.65 C13.1
  Top 0.254: 15.8,26.35 15.8,23.15 15.35,22.65
N$7  (1 unrouted)
  Top 0.25: R2.2 7.46,19.41 7.46,19.34 | R8.2 9.4,19.75
  Top 0.254: 9.4,19.75 7.87,19.75 7.46,19.34 7.37,19.24 7.37,17.72
N$8  (1 unrouted)
  Bottom 0.25: R9.2 12.45,19.75 | R3.2 14.48,19.55
  Bottom 0.254: 14.48,17.97 R3.2 14.48,19.55 14.48,19.75 12.45,19.75
N$9
  Top 0.25: 18.3,26.3 18.28,26.3 U$1.43 | C12.1 19.4,22.58 19.4,22.6
  Top 0.254: 18.3,26.3 18.3,24.45 19.4,23.35 19.4,22.6
N$10  (1 unrouted)
  Bottom 0.25: R11.2 24.64,19.75 | R5.2 26.67,19.45
  Bottom 0.254: 26.67,17.72 R5.2 26.67,19.45 26.67,19.49 26.67,19.75 24.64,19.75
N$11
  Top 0.25: 31.75,17.72 31.86,17.72 Q6.4 | 33.78,19.75 R12.2 | R6.2 31.75,19.55
  Top 0.254: 33.78,19.75 31.75,19.75 31.75,19.55 R6.2 31.75,17.72
N$12
  Top 0.25: U$1.3 23.8,34.33 23.8,34.35 | R19.2 26.35,32.62 26.35,32.8 | R18.1 29.05,33.4
  Top 0.254: 23.8,34.35 23.8,32.95 23.95,32.8 26.35,32.8 28.3,32.8 29.05,33.4
N$13
  Top 0.25: 21.8,34.3 21.78,34.3 U$1.7 | R17.2
  Top 0.254: R17.2 21.9,35.15 21.8,35.05 21.8,34.3
N$14
  Top 0.25: U$1.27 11.8,34.33 11.8,34.25 | 10,31.25 C19.1
  Top 0.254: 11.8,34.35 11.8,34.25 11.8,33 10.25,31.5 10,31.3 10,31.25
N$15
  Top 0.25: 18.3,34.3 18.28,34.3 U$1.14 | C20.2 17.95,38.6
  Top 0.254: 17.95,38.6 18.8,37.75 18.8,36.1 18.3,35.6 18.3,34.3
N$16
  Top 0.25: 17.8,34.3 17.78,34.3 U$1.15 | C20.1 17.95,36.9
  Top 0.254: 17.95,36.9 17.95,35.95 17.8,35.8 17.8,34.3
N$17
  Top 0.25: U$1.13 18.8,34.33 18.8,34.3 | C21.1 19.8,36.22 19.8,36.3
  Top 0.254: 19.9,36.4 19.8,36.3 18.8,35.3 18.8,34.3 18.8,34.25
N$18  (1 unrouted)
  Top 0.25: U$1.2 24.3,34.33 24.3,34.35 | C23.2 26,37.45
  Top 0.254: 24.3,34.35 24.3,36.1 24.65,36.1 26,37.45
N$19
  Top 0.25: U$1.1 24.8,34.33 24.8,34.3 | R20.2
  Top 0.254: R20.2 25.05,34.05 24.8,34.3
N$20
  Top 0.25: R21.1 24.3,37.76 24.3,37.75 | C22.2
  Top 0.254: C22.2 24.35,37.8 24.3,37.75
N$21
  Top 0.25: 29.1,29.5 28.87,29.5 L1.1 | U$1.50 21.8,26.23 21.8,26.3 | 22.3,26.35 22.28,26.35 U$1.51 | 23.85,23.95 23.85,23.85 | 26.45,24.15 C25.2 | D7.C 29.1,25.68 29.1,25.45
  Top 0.254: 22.3,26.35 22.3,25.5 23.85,23.95 26.05,24 26.45,24.15 | 21.8,26.4 21.8,26.3 21.8,25.8 23.75,23.85 23.85,23.85 26.55,23.85
  Top 0.61: 26.45,24.15 28,24.15 29.1,25.25 29.1,25.45 29.1,29.5 28.8,29.8
N$22  (1 unrouted)
  Top 0.25: 22.8,26.35 22.78,26.35 U$1.52
  Top 0.254: 22.8,26.35 22.8,25.65 24,24.45 25.15,24.45 26.5,25.8
N$23
  Top 0.25: 24.8,26.25 24.78,26.25 U$1.56 | C26.2
  Top 0.254: 24.8,26.25 24.8,26.75 25.35,27.3 26.45,27.3 C26.2
N$24  (via drill 0.35)
  Top 0.25: U$3.14 12.1,52.5 | C28.1 | R27.2 7.75,25.52 7.75,25.5 | 9.7,25.5 v9.7,25.55 v9.71,25.55 R26.1
  Top 0.254: C28.1 7.75,25.5 9.7,25.5 | 12.1,52.55 12.1,52.5 12.1,50.65 v12.15,50
  Bottom 0.254: v12.15,50 12.15,49.5 12.25,49.4 12.75,49.4 13.2,48.9 13.2,46.55 11.75,45.1 11.75,37.7 9.65,35.55 9.65,25.6 v9.7,25.55
N$26
  Top 0.254: R16.1 29.5,51.73 LED1.A
N$27  (via drill 0.35)  (2 unrouted)
  Top 0.25: R4.2 v19.15,19.35 19.56,19.35 19.56,19.4
  Top 0.254: 19.56,19.4 19.56,17.82
  Bottom 0.254: v19.15,19.35 21.15,19.35 v21.6,19.85
N$28
  Top 0.254: R22.1 2.4,42.88 LED2.A
N$30
  Top 0.254: U$3.6 16.11,54.59 XT1.3
NRST  (via drill 0.35)
  Top 0.254: U$3.7 15.61,51.79 16.45,50.95 v16.7,50.95 | v22.35,49.2 23.55,49.2 24.25,49.9 25,49.9 v25.5,50.4
  Bottom 0.254: v25.5,50.4 25.5,51.52 PROG.5 | v22.35,49.2 22.35,49.6 21.8,50.25 20.45,50.25 19.6,51 16.65,51 v16.7,50.95
SCK  (via drill 0.32)
  Top 0.254: U$3.51 19.22,44.03 18.2,45.05 18.2,45.4 18.05,45.55 16.95,45.55 v16.8,45.55
  Bottom 0.254: v16.8,45.55 16.8,43.95 16.7,43.75 U$7.2
SLB
  Top 0.25: 13.3,26.3 13.28,26.3 U$1.33 | U$1.39 16.3,26.23 16.3,26.25 | 21.59,18.22 R10.1
  Top 0.254: 21.59,18.22 R10.1 21.59,16.95 | R10.1 21.45,18.15 20.6,19 20.6,20.2 17.25,20.2 16.3,21.15 16.3,21.2 | 16.3,21.2 16.3,26.25 16.3,26.35 | 13.3,26.3 13.3,24.1 12.7,23.5 12.7,21.55 13.05,21.2 16.3,21.2
  pour Top (isolate 0.305, no thermals): 19.05,16.95 22.35,16.95 22.35,13.65 19.05,13.65
SLC
  Top 0.25: U$1.31 12.3,26.23 12.3,26.3 | 13.8,26.25 13.78,26.25 U$1.34 | 9.4,18.22 R8.1
  Top 0.254: 9.4,18.22 R8.1 9.4,16.95 | 12.3,26.55 12.3,27.1 | 12.3,27.1 12.3,26.55 | 12.3,26.55 12.3,26.45 | 12.3,26.45 12.3,26.55 | 12.3,26.55 12.3,27.1 | 12.3,27.1 13.8,27.1 13.8,26.25 | 12.3,26.45 12.3,26.3 12.3,25 11.9,24.6 10.7,23.4 10.7,19.45 R8.1
  pour Top (isolate 0.305, no thermals): 6.86,16.95 10.16,16.95 10.16,13.65 6.86,13.65
SO1  (via drill 0.35)
  Top 0.25: 12.8,34.35 12.78,34.35 U$1.25
  Top 0.254: 12.8,34.35 12.8,35.4 v12.65,35.55 | v13.85,50 14.61,50.76 U$3.9
  Bottom 0.254: v12.65,35.55 12.5,35.55 11.85,36.2 11.85,36.95 12.25,37.35 12.25,44.9 13.75,46.4 13.75,49.75 v13.85,50
SO2  (via drill 0.35)
  Top 0.25: 15.11,52.55 U$3.8 | U$1.26 12.3,34.33 12.3,34.35
  Top 0.254: v12.75,36.7 12.6,36.55 11.85,35.8 11.85,35.35 12.3,34.9 12.3,34.35 12.3,34.3 | v15.05,50.05 15.11,50.11 U$3.8
  Bottom 0.254: v12.75,36.7 12.75,44.7 14.25,46.2 14.25,48.8 15.05,49.6 v15.05,50.05
SWO  (via drill 0.35)
  Top 0.254: v23.7,46.05 20.64,46.05 U$3.55
  Bottom 0.254: PROG.6 26.55,48.35 24.25,46.05 v23.7,46.05
TCK  (via drill 0.35)
  Top 0.254: v22.25,42.85 21.89,43 U$3.49
  Bottom 0.254: PROG.2 22.55,50.2 23.2,49.55 23.4,49.35 23.4,48.45 22.25,47.3 v22.25,42.85
TMS  (via drill 0.35)
  Top 0.254: U$3.46 17.65,41.06 17.65,41.95 17.85,42.15 19.1,42.15 19.75,41.5 v21,41.5 | v24.95,42.9 v24.95,48.1
  Bottom 0.254: PROG.4 24.55,48.55 v24.95,48.1 | v21,41.5 21.1,41.45 24.15,41.4 24.95,42.2 v24.95,42.9
USART_RX  (via drill 0.35)
  Top 0.254: U$3.17 10.28,50.53 v10.35,50.6
  Bottom 0.254: v10.35,50.6 10.35,51.48 SER.2
USART_TX  (via drill 0.35)
  Top 0.254: v8.1,52.05 8.1,52.45 8.3,52.65 10.99,52.65 U$3.16
  Bottom 0.254: SER.1 8.62,51.52 v8.1,52.05

### Text on the board
tNames: HK.C. Integrated / Ben Katz / 11/17 - 4 layer